# EAGLE schematic portal parkir (EAGLE 9.6.2)
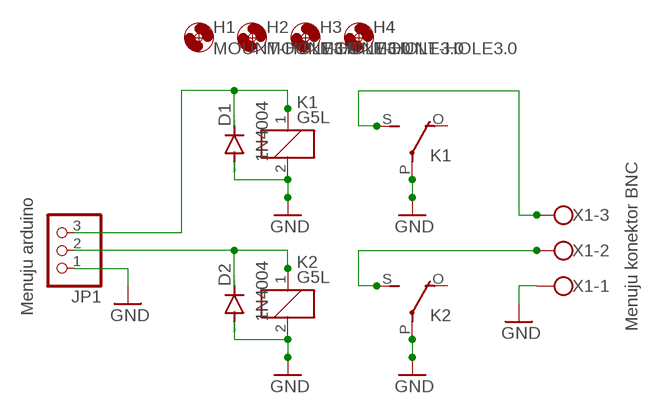
[diagram p0: schematic, sheet 1]

## Parts
D1  1N4004  [DO41-10]
D2  1N4004  [DO41-10]
H1  MOUNT-HOLE3.0  [3,0]
H2  MOUNT-HOLE3.0  [3,0]
H3  MOUNT-HOLE3.0  [3,0]
H4  MOUNT-HOLE3.0  [3,0]
JP1  PINHD-1X3  [1X03]
K1  G5L  [G5LE]
K2  G5L  [G5LE]
X1  W237-103  [W237-103]

## Nets
GND: D1.A D2.A JP1.1 K1.2 K1.P(2:P) K2.2 K2.P(2:P) X1.1
N$1: D1.C JP1.3 K1.1
N$2: D2.C JP1.2 K2.1
N$4: K2.S(2:S) X1.2
N$5: K1.S(2:S) X1.3
Unconnected: K1.O(2:O) K2.O(2:O)

## Notes on the sheet
- Menuju konektor BNC
- Menuju arduino

## Library data of the parts
D1 D2 = diode:1N4004: DIODE general purpose rectifier, 1 A
H1-H4 = holes:MOUNT-HOLE: MOUNTING HOLE with drill center marker
JP1 = pinhead:PINHD-1X3: PIN HEADER
K1 K2 = relay:G5L: RELAY 1 x switch, 10 A/120 V AC, 8 A/30 V ADC, Omron; OC_FARNELL: unknown; OC_NEWARK: unknown
X1 = con-wago-500:W237-103: WAGO SCREW CLAMP; MPN: 237-103; OC_FARNELL: unknown; OC_NEWARK: 18M7116